# Altium project Project_Xe_Can_Bang.PrjPCB
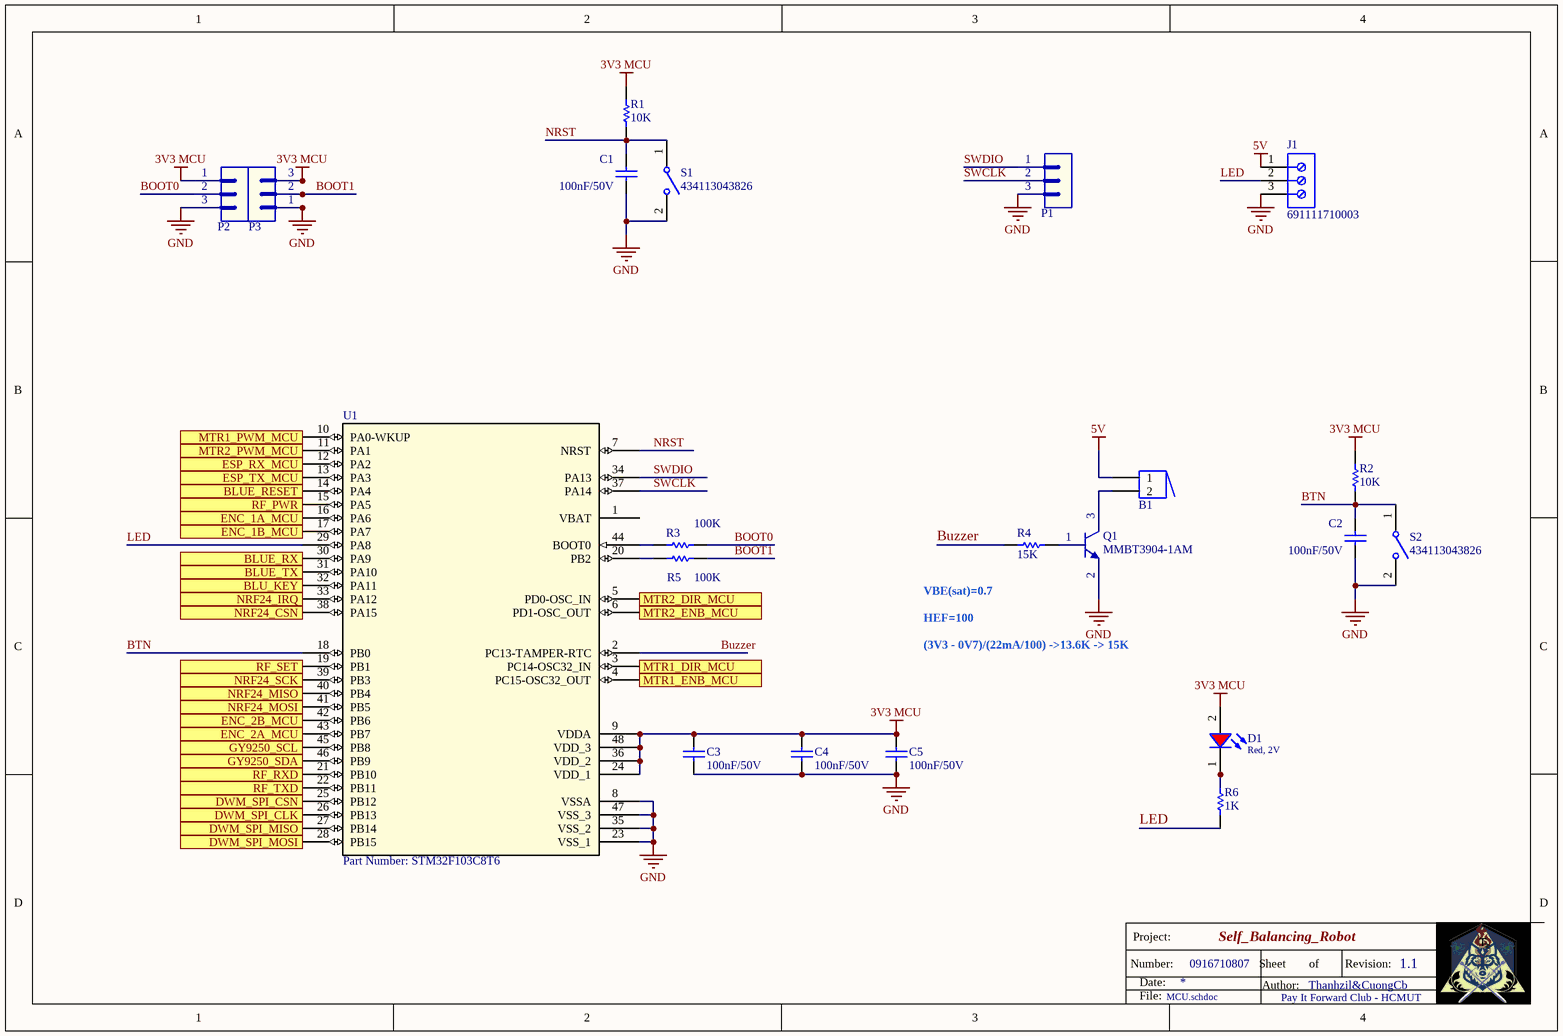
[diagram p0: MCU.SchDoc]
8 sheets, 152 parts. Net scope: flat (ports and power ports of the same name join across sheets).
Board file: Project_Xe_Can_Bang.PcbDoc
Sheets:
  MCU.SchDoc
  Power_Supply.SchDoc
  Sensor.SchDoc
  Motor_Controller.SchDoc
  Bluetooth.SchDoc
  Decawave.SchDoc
  RF.SchDoc
  Wifi.SchDoc

## Sheet MCU.SchDoc
size A4

### Parts
B1  Buzzer  [BUZZER]  (value not drawn)
C1  value 100nF/50V  [CAP-SM-0805]  (hidden comment: Cap-100nF-50V-0805)
C2  value 100nF/50V  [CAP-SM-0805]  (hidden comment: Cap-100nF-50V-0805)
C3  value 100nF/50V  [CAP-SM-0805]  (hidden comment: Cap-100nF-50V-0805)
C4  value 100nF/50V  [CAP-SM-0805]  (hidden comment: Cap-100nF-50V-0805)
C5  value 100nF/50V  [CAP-SM-0805]  (hidden comment: Cap-100nF-50V-0805)
D1  Red, 2V  [WL-SMCW_0805]
J1  691111710003  [691111710003]
P1  Header 3  [JP3]  (value not drawn)
P2  Header 3  [JP3]  (value not drawn)
P3  Header 3  [JP3]  (value not drawn)
Q1  MMBT3904-1AM  [SOT23_NEX]
R1  value 10K  [RES-SM-0805]  (hidden comment: Res-10k-0805)
R2  value 10K  [RES-SM-0805]  (hidden comment: Res-10k-0805)
R3  value 100K  [RES-SM-0805]  (hidden comment: Res-100K-0805)
R4  value 15K  [RES-SM-0805]  (hidden comment: Res-15K-0805)
R5  value 100K  [RES-SM-0805]  (hidden comment: Res-100K-0805)
R6  value 1K  [RES-SM-0805]  (hidden comment: Res-1K-0805)
S1  434113043826  [434113043826]
S2  434113043826  [434113043826]
U1  Part Number: STM32F103C8T6  [LQFP - 48]

### Ports
BLU_KEY (out), BLUE_RESET (out), BLUE_RX (out), BLUE_TX (in), DWM_SPI_CLK (out), DWM_SPI_CSN (out), DWM_SPI_MISO (in), DWM_SPI_MOSI (out), ENC_1A_MCU (in), ENC_1B_MCU (in), ENC_2A_MCU (in), ENC_2B_MCU (in), ESP_RX_MCU (out), ESP_TX_MCU (in), GY9250_SCL (out), GY9250_SDA (out), MTR1_DIR_MCU (out), MTR1_ENB_MCU (out), MTR1_PWM_MCU (out), MTR2_DIR_MCU (out), MTR2_ENB_MCU (out), MTR2_PWM_MCU (out), NRF24_CSN (out), NRF24_IRQ (in), NRF24_MISO (in), NRF24_MOSI (out), NRF24_SCK (out), RF_PWR (out), RF_RXD (out), RF_SET (out), RF_TXD (in)

### Nets
3V3 MCU: C3.2 C4.1 C5.2 D1.2(A) P2.1 P3.3 R1.2 R2.2 U1.9(VDDA) U1.24(VDD_1) U1.36(VDD_2) U1.48(VDD_3)
5V: B1.1 J1.1
GND: C1.1 C2.1 C3.1 C4.2 C5.1 J1.3 P1.3 P2.3 P3.1 Q1.2(E) S1.2 S2.2 U1.8(VSSA) U1.23(VSS_1) U1.35(VSS_2) U1.47(VSS_3)
BLU_KEY: U1.32(PA11) ; port BLU_KEY
BLUE_RX: U1.30(PA9) ; port BLUE_RX
BLUE_TX: U1.31(PA10) ; port BLUE_TX
BOOT0: P2.2 R3.2
BOOT1: P3.2 R5.2
BTN: C2.2 R2.1 S2.1 U1.18(PB0)
Buzzer: R4.1 U1.2(PC13-TAMPER-RTC)
DWM_SPI_CLK: U1.26(PB13) ; port DWM_SPI_CLK
DWM_SPI_CSn: U1.25(PB12) ; port DWM_SPI_CSN
DWM_SPI_MISO: U1.27(PB14) ; port DWM_SPI_MISO
DWM_SPI_MOSI: U1.28(PB15) ; port DWM_SPI_MOSI
ESP_TX: U1.13(PA3) ; port ESP_TX_MCU
LED: J1.2 R6.1 U1.29(PA8)
NRST: C1.2 R1.1 S1.1 U1.7(NRST)
RF_RXD: U1.21(PB10) ; port RF_RXD
RF_SET: U1.19(PB1) ; port RF_SET
RF_TXD: U1.22(PB11) ; port RF_TXD
SWCLK: P1.2 U1.37(PA14)
SWDIO: P1.1 U1.34(PA13)
NetB1_2: B1.2 Q1.3(C)
NetB2_3: U1.45(PB8) ; port GY9250_SCL
NetB2_4: U1.46(PB9) ; port GY9250_SDA
NetD1_1: D1.1(K) R6.2
NetM4_11: U1.14(PA4) ; port BLUE_RESET
NetM5_4: U1.38(PA15) ; port NRF24_CSN
NetM5_5: U1.39(PB3) ; port NRF24_SCK
NetM5_6: U1.41(PB5) ; port NRF24_MOSI
NetM5_7: U1.40(PB4) ; port NRF24_MISO
NetM5_8: U1.33(PA12) ; port NRF24_IRQ
NetQ1_1: Q1.1(B) R4.2
NetR3_1: R3.1 U1.44(BOOT0)
NetR5_1: R5.1 U1.20(PB2)
NetR8_1: U1.15(PA5) ; port RF_PWR
NetR28_1: U1.12(PA2) ; port ESP_RX_MCU
NetU1_3: U1.3(PC14-OSC32_IN) ; port MTR1_DIR_MCU
NetU1_4: U1.4(PC15-OSC32_OUT) ; port MTR1_ENB_MCU
NetU1_5: U1.5(PD0-OSC_IN) ; port MTR2_DIR_MCU
NetU1_6: U1.6(PD1-OSC_OUT) ; port MTR2_ENB_MCU
NetU1_10: U1.10(PA0-WKUP) ; port MTR1_PWM_MCU
NetU1_11: U1.11(PA1) ; port MTR2_PWM_MCU
NetU1_16: U1.16(PA6) ; port ENC_1A_MCU
NetU1_17: U1.17(PA7) ; port ENC_1B_MCU
NetU1_42: U1.42(PB6) ; port ENC_2B_MCU
NetU1_43: U1.43(PB7) ; port ENC_2A_MCU

Not connected (* = marked no-connect by the designer): U1 1(VBAT)

### Notes on the sheet
- Labels drawn without touching a wire or pin: (3V3 - 0V7)/(22mA/100) ->13.6K -> 15K, HEF=100, VBE(sat)=0.7
- Date:
- Project:
- Number:
- 0916710807
- Self_Balancing_Robot
- Sheet
- Author:
- of
- Revision:
- 1.1
- Thanhzil&CuongCb
- Pay It Forward Club - HCMUT
- File:
- MCU.schdoc

### Library data of the parts
C1-C5 = Cap-100nF-50V-0805: CAP CER 0.1UF 50V Y5V 0805; Manufacturer: Samsung Electro-Mechanics; Manufacturer Part Number: CL21F104ZBCNNNC; Local Supplier: thegioiic; Local Supplier Link: https://thegioiic.com/products/tu-100nf-0-1uf-50v-0805; Supplier 1: Digikey; Supplier 1 Part Number: 1276-1007-1-ND; Supplier 1 Link: https://www.digikey.com/product-detail/en/samsung-electro-mechanics/CL21F104ZBCNNNC/1276-1007-1-ND/3889093
D1 = 150080RS75000: WL-SMCW SMT Mono-color Chip LED Waterclear, size 0805, Red, 2V, 140deg; Chip Technology: AlInGaP; Dominant Wavelength typ.: 625nm; Luminous Intensity typ.: 150mcd; Peak Wavelength typ.: 630nm; Viewing Angle: 140deg; ComponentLink1Description: Manufacturer; ComponentLink1URL: http://www.we-online.de; ComponentLink2URL: https://www.we-online.com/catalog/datasheet/150080RS75000.pdf; ComponentLink2Description: Datasheet; Forward Voltage typ.: 2V; Emitting Color: Red; Mounting Technology: SMT; Operating Temperature: -40 to +85degC; Published Date: December 2019; Part Number: 150080RS75000; Packaging: Tape and Reel; Size: 0805; Publisher: Wurth Elektronik
J1 = 691111710003: WR-TBL Serie 111 Horizontal Entry Modular, Pressure Clamp, pitch 5mm, 3p; Compliance: Lead free / RoHS; Modularity: Yes; PCB/Cable/Panel: PCB; Pin Number: 3; Rated Current [UL]: 15A; Working Voltage [UL]: 250VAC; ComponentLink1Description: Manufacturer; ComponentLink1URL: http://www.we-online.de; ComponentLink2URL: https://katalog.we-online.de/em/datasheet/691111710003.pdf; ComponentLink2Description: Datasheet; Mounting Technology: THT; Part Number: 691111710003; Packaging: Box; Operating Temperature: -40 to +105degC; Pitch: 5mm; Published Date: October 2019; Type: Horizontal; Publisher: Wurth Elektronik; Application: Pressure Clamp
P1-P3 = Header 3: Header, 3-Pin; LatestRevisionDate: 17-Jul-2002; LatestRevisionNote: Re-released for DXP Platform.; Publisher: Altium Limited
R1 R2 = Res-10k-0805: RES 10K OHM 1% 1/4W 0805; Manufacturer: Stackpole Electronics Inc; Manufacturer Part Number: RNCP0805FTD10K0; Local Supplier: thegioiic; Local Supplier Link: https://thegioiic.com/products/dien-tro-10k-ohm-0805-5; Supplier 1: Digikey; Supplier 1 Link: https://www.digikey.com/product-detail/en/stackpole-electronics-inc/RNCP0805FTD10K0/RNCP0805FTD10K0CT-ND/2240601; Supplier 1 Part Number: RNCP0805FTD10K0CT-ND
R3 R5 = Res-100K-0805: RES 0 OHM JUMPER 0805; Manufacturer: Vishay Dale; Manufacturer Part Number: WSL080500000ZEA9; Local Supplier: thegioiic; Local Supplier Link: https://thegioiic.com/products/dien-tro-0-ohm-0805-5; Supplier 1: Digikey; Supplier 1 Link: https://www.digikey.com/product-detail/en/vishay-dale/WSL080500000ZEA9/541-3928-1-ND/7423223; Supplier 1 Part Number: 541-3928-1-ND
R4 = Res-15K-0805: RES 15K OHM 1% 1/4W 0805; Manufacturer: TE Connectivity Passive Product; Manufacturer Part Number: CRGCQ0805F15K; Local Supplier: thegioiic; Local Supplier Link: https://thegioiic.com/products/dien-tro-15k-ohm-0805-1; Supplier 1: Digikey; Supplier 1 Part Number: A129763CT-ND; Supplier 1 Link: https://www.digikey.com/product-detail/en/te-connectivity-passive-product/CRGCQ0805F15K/A129763CT-ND/8577595
R6 = Res-1K-0805: RES 1K OHM 1% 1/4W 0805; Manufacturer: Stackpole Electronics Inc; Manufacturer Part Number: RNCP0805FTD1K00; Local Supplier: thegioiic; Local Supplier Link: https://thegioiic.com/products/dien-tro-1k-ohm-0805-5; Supplier 1: Digikey; Supplier 1 Link: https://www.digikey.com/product-detail/en/stackpole-electronics-inc/RNCP0805FTD1K00/RNCP0805FTD1K00CT-ND/2240568; Supplier 1 Part Number: RNCP0805FTD1K00CT-ND
S1 S2 = 434113043826: WS-TASV J-Bend SMT Tact Switch 6x3.5mm, height 4.3mm, 260gf; Rated Voltage: 12VDC; Rated Current: 50mA; Washable: No; ComponentLink1Description: Manufacturer; ComponentLink1URL: http://www.we-online.de; ComponentLink2Description: Datasheet; ComponentLink2URL: https://katalog.we-online.com/em/datasheet/434113043826.pdf; Operating Temperature: -40 to +85degC; Part Number: 434113043826; Published Date: September 2019; Contact Material: Stainless Steel; Height: 4.3mm; Mounting Technology: SMT; Contact Plating: Silver; Operation Force: 260gf; Packaging: Tape and Reel; Terminal Material: Copper Alloy; Publisher: Wurth Elektronik; Terminal Plating: Silver
U1 = STM32F103C8T6: Vendor: STMicroelectronics; Built_By: EMA_UL_Team; Manufacturer_Part_Number: STM32F103C8T6; Copyright: Copyright (C) 2018 Accelerated Designs. All rights reserved; RefDes: RefDes; Type: DEV; Value: Value

## Sheet Power_Supply.SchDoc
size A4
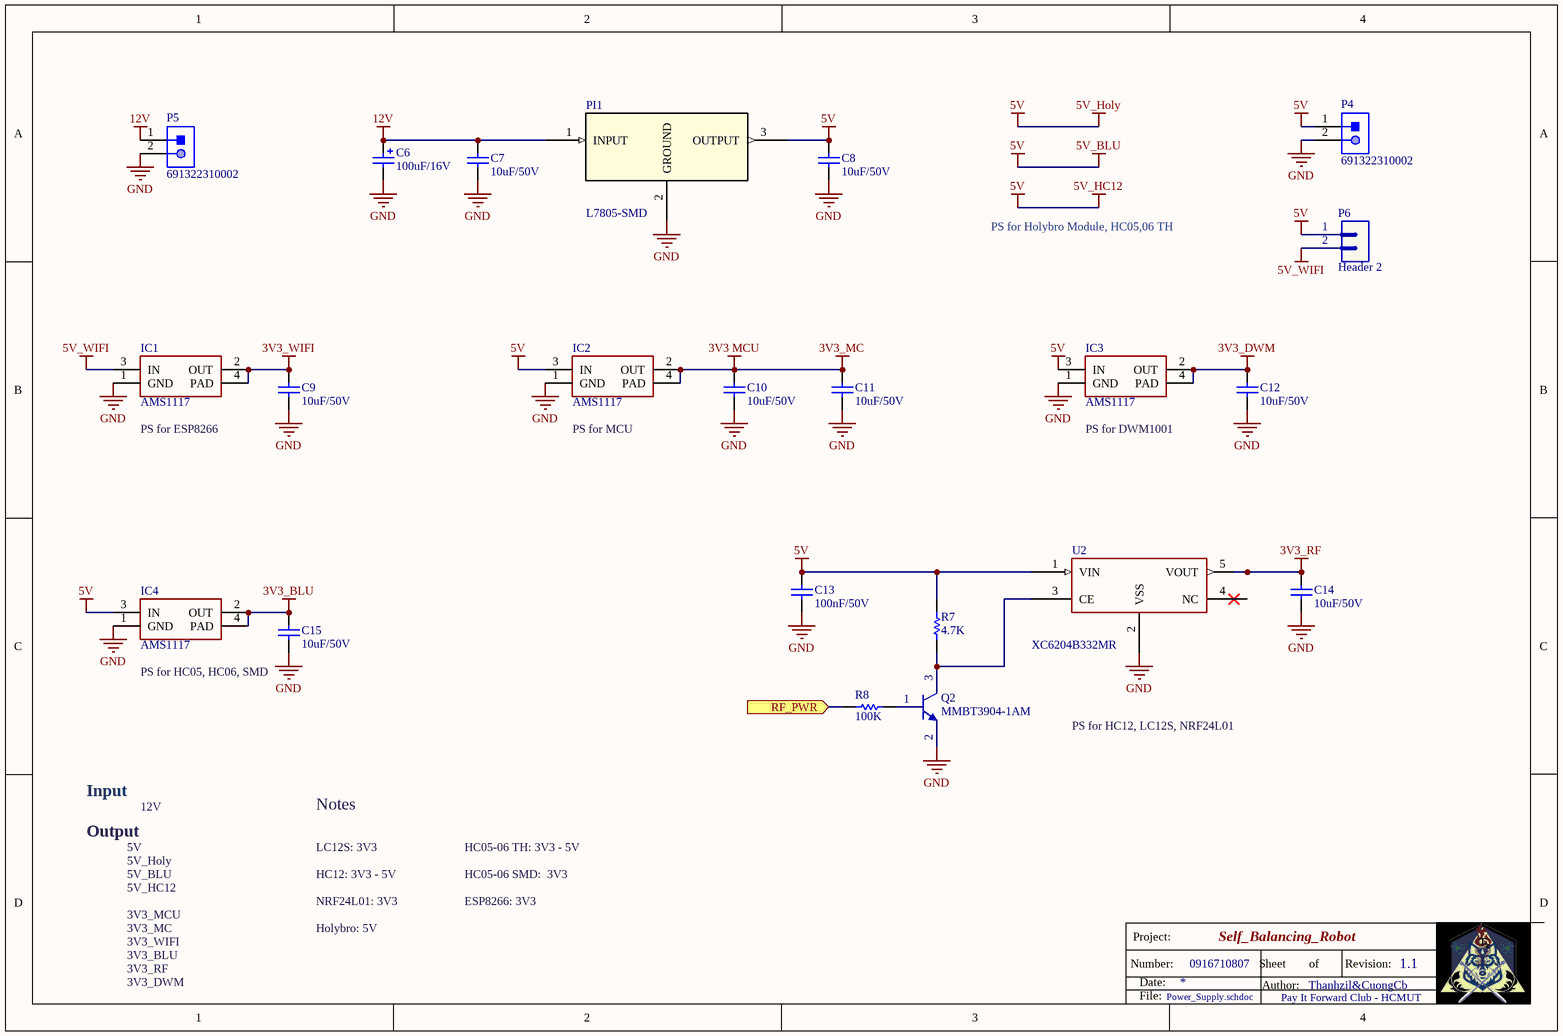
[diagram p1: Power_Supply.SchDoc]

### Parts
C6  value 100uF/16V  [CAP-SM-AL-SIZE-D-D6L6]  (hidden comment: Cap-Al-100uF-16V-D6L5)
C7  value 10uF/50V  [CAP-SM-0805]  (hidden comment: Cap-10uF-50V-0805)
C8  value 10uF/50V  [CAP-SM-0805]  (hidden comment: Cap-10uF-50V-0805)
C9  value 10uF/50V  [CAP-SM-0805]  (hidden comment: Cap-10uF-50V-0805)
C10  value 10uF/50V  [CAP-SM-0805]  (hidden comment: Cap-10uF-50V-0805)
C11  value 10uF/50V  [CAP-SM-0805]  (hidden comment: Cap-10uF-50V-0805)
C12  value 10uF/50V  [CAP-SM-0805]  (hidden comment: Cap-10uF-50V-0805)
C13  value 100nF/50V  [CAP-SM-0805]  (hidden comment: Cap-100nF-50V-0805)
C14  value 10uF/50V  [CAP-SM-0805]  (hidden comment: Cap-10uF-50V-0805)
C15  value 10uF/50V  [CAP-SM-0805]  (hidden comment: Cap-10uF-50V-0805)
IC1  AMS1117  [SOT223]
IC2  AMS1117  [SOT223]
IC3  AMS1117  [SOT223]
IC4  AMS1117  [SOT223]
P4  691322310002  [691322310002]
P5  691322310002  [691322310002]
P6  Header 2  [JP2]
PI1  L7805-SMD  [D2PAK_STM]
Q2  MMBT3904-1AM  [SOT23_NEX]
R7  value 4.7K  [RES-SM-0805]  (hidden comment: Res-4.7K-0805)
R8  value 100K  [RES-SM-0805]  (hidden comment: Res-100K-0805)
U2  XC6204B332MR  [XC6204/05_SOT-00]

### Ports
RF_PWR (in)

### Nets
3V3 MCU: C10.2 C11.2 IC2.2(OUT) IC2.4(PAD)  [also labelled 3V3_MC]
3V3_BLU: C15.2 IC4.2(OUT) IC4.4(PAD)
3V3_DWM: C12.2 IC3.2(OUT) IC3.4(PAD)
3V3_RF: C14.2 U2.5(VOUT)
3V3_WIFI: C9.2 IC1.2(OUT) IC1.4(PAD)
5V: C8.2 C13.2 IC2.3(IN) IC3.3(IN) IC4.3(IN) P4.1 P6.1 PI1.3(OUTPUT) R7.2 U2.1(VIN)  [also labelled 5V_BLU, 5V_HC12, 5V_Holy]
5V_WIFI: IC1.3(IN) P6.2
12V: C6.1 C7.2 P5.1 PI1.1(INPUT)
GND: C6.2 C7.1 C8.1 C9.1 C10.1 C11.1 C12.1 C13.1 C14.1 C15.1 IC1.1(GND) IC2.1(GND) IC3.1(GND) IC4.1(GND) P4.2 P5.2 PI1.2(GROUND) Q2.2(E) U2.2(VSS)
NetQ2_1: Q2.1(B) R8.2
NetQ2_3: Q2.3(C) R7.1 U2.3(CE)
NetR8_1: R8.1 ; port RF_PWR

Not connected (* = marked no-connect by the designer): U2 4(NC)

### Notes on the sheet
- Labels drawn without touching a wire or pin: 3V3_BLU, 3V3_DWM, 3V3_MC, 3V3_MCU, 3V3_RF, 3V3_WIFI, 5V, 5V_BLU, 5V_HC12, 5V_Holy, 12V, ESP8266: 3V3, HC05-06 SMD:  3V3, HC05-06 TH: 3V3 - 5V, HC12: 3V3 - 5V, Holybro: 5V, Input, LC12S: 3V3, Notes, NRF24L01: 3V3, Output, PS for DWM1001, PS for ESP8266, PS for HC05, HC06, SMD, PS for HC12, LC12S, NRF24L01, PS for Holybro Module, HC05,06 TH, PS for MCU
- Date:
- Project:
- Number:
- 0916710807
- Self_Balancing_Robot
- Sheet
- Author:
- of
- Revision:
- 1.1
- Thanhzil&CuongCb
- Pay It Forward Club - HCMUT
- File:
- Power_Supply.schdoc

### Library data of the parts
C6 = Cap-Al-100uF-16V-D6L5: CAP ALUM 100UF 20% 16V SMD; Manufacturer: Nichicon; Manufacturer Part Number: UWX1C101MCL1GB; Local Supplier: thegioiic; Local Supplier Link: https://thegioiic.com/products/tu-nhom-smd-100uf-16v-d6-3l5-4; Supplier 1: Digikey; Supplier 1 Part Number: 493-2105-1-ND; Supplier 1 Link: https://www.digikey.com/product-detail/en/nichicon/UWX1C101MCL1GB/493-2105-1-ND/590080
C7-C12 C14 C15 = Cap-10uF-50V-0805: CAP CER 10UF 50V X5R 0805; Manufacturer: Yageo; Manufacturer Part Number: CC0805KKX5R9BB106; Local Supplier: thegioiic; Local Supplier Link: https://thegioiic.com/products/tu-10uf-50v-0805; Supplier 1: Digikey; Supplier 1 Link: https://www.digikey.com/product-detail/en/yageo/CC0805KKX5R9BB106/311-3499-2-ND/7164383; Supplier 1 Part Number: 311-3499-2-ND
C13 = Cap-100nF-50V-0805: as C1 on sheet MCU; Local Supplier: thegioiic; Local Supplier Link: https://thegioiic.com/products/tu-100nf-0-1uf-50v-0805; Supplier 1: Digikey; Supplier 1 Part Number: 1276-1007-1-ND; Supplier 1 Link: https://www.digikey.com/product-detail/en/samsung-electro-mechanics/CL21F104ZBCNNNC/1276-1007-1-ND/3889093
IC1-IC4 = AMS1117: Available in 1.8V, 2.5V, 2.85V, 3.3V, 5V, and  Adjustable Versions; Value: LM317
P4 P5 = 691322310002: WR-TBL Serie 322 Horizontal PCB Header, Pluggable, pitch 3.81mm, 2p; Compliance: RoHS; Modularity: No; Pin Number: 2; Rated Current [UL]: 10A; Working Voltage [UL]: 300VAC; ComponentLink1Description: Manufacturer; ComponentLink1URL: http://www.we-online.de; ComponentLink2URL: https://katalog.we-online.de/em/datasheet/691322310002.pdf; ComponentLink2Description: Datasheet; Mounting Technology: THT; Part Number: 691322310002; Packaging: Box; Operating Temperature: -40 to +105degC; PCB/Cable/Panel: PCB; Pitch: 3.81mm; Published Date: October 2019; Type: Horizontal; Publisher: Wurth Elektronik; Application: Pluggable
P6 = Header 2: Header, 2-Pin; LatestRevisionDate: 17-Jul-2002; LatestRevisionNote: Re-released for DXP Platform.; Publisher: Altium Limited
PI1 = L7805CD2T-TR: No Description Available; SourceLibrary: StMicro_2011-06-07; Built_By: EMA_UL_Team; Vendor: STMicroelectronics; Manufacturer_Part_Number: L7805CD2T-TR; Copyright: Copyright (C) 2018 Accelerated Designs. All rights reserved; RefDes: RefDes; Type: DEV
R7 = Res-4.7K-0805: RES SMD 4.7K OHM 5% 1/8W 0805; Manufacturer: Yageo; Manufacturer Part Number: RC0805JR-074K7L; Local Supplier: thegioiic; Local Supplier Link: https://thegioiic.com/products/dien-tro-4-7k-ohm-0805-5; Supplier 1: Digikey; Supplier 1 Link: https://www.digikey.com/product-detail/en/yageo/RC0805JR-074K7L/311-4.7KARCT-ND/731274; Supplier 1 Part Number: 311-4.7KARCT-ND
R8 = Res-100K-0805: as R3 on sheet MCU; Local Supplier: thegioiic; Local Supplier Link: https://thegioiic.com/products/dien-tro-0-ohm-0805-5; Supplier 1: Digikey; Supplier 1 Link: https://www.digikey.com/product-detail/en/vishay-dale/WSL080500000ZEA9/541-3928-1-ND/7423223; Supplier 1 Part Number: 541-3928-1-ND
U2 = XC6204B332MR: Vendor: Torex Semiconductor; Built_By: EMA_UL_Team; SourceLibrary: Torex_2016-07-05_1; Manufacturer_Part_Number: XC6204B332MR; Copyright: Copyright (C) 2018 Accelerated Designs. All rights reserved; RefDes: RefDes; Type: DEV

## Sheet Sensor.SchDoc
size A4
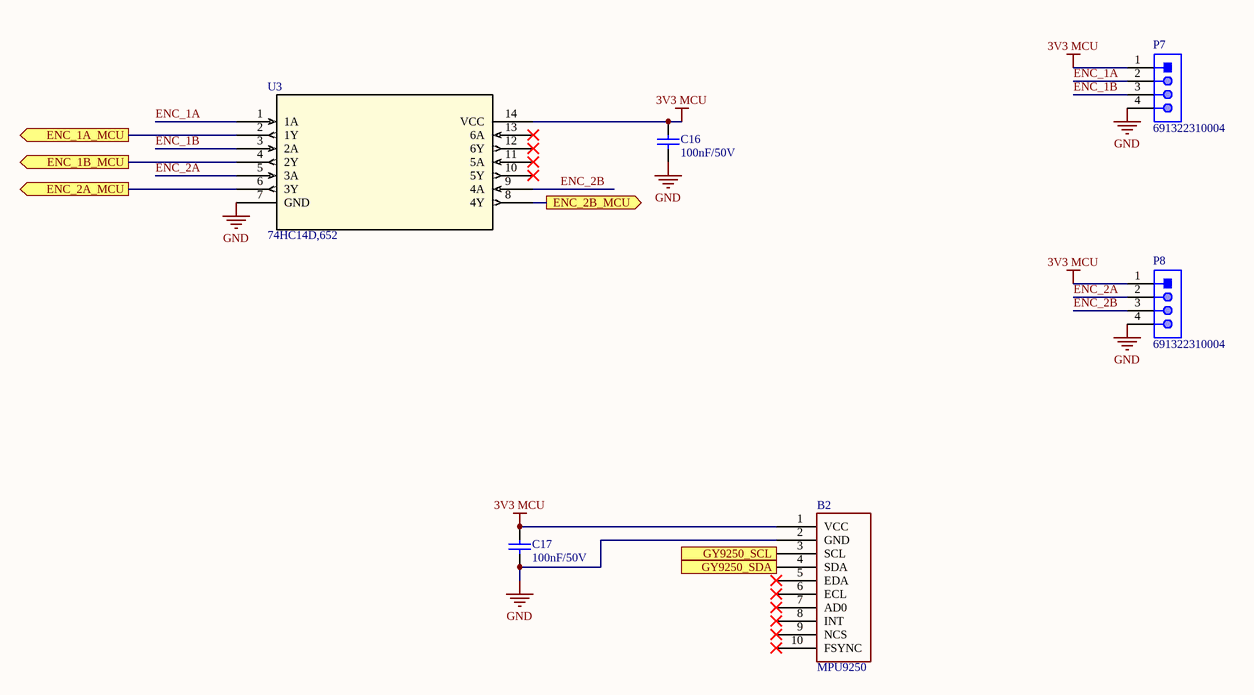
[diagram p2: Sensor.SchDoc]

### Parts
B2  MPU9250  [MPU9250]
C16  value 100nF/50V  [CAP-SM-0805]  (hidden comment: Cap-100nF-50V-0805)
C17  value 100nF/50V  [CAP-SM-0805]  (hidden comment: Cap-100nF-50V-0805)
P7  691322310004  [691322310004]
P8  691322310004  [691322310004]
U3  74HC14D,652  [SOT108-1_NEX]

### Ports
ENC_1A_MCU (out), ENC_1B_MCU (out), ENC_2A_MCU (out), ENC_2B_MCU (out), GY9250_SCL (in), GY9250_SDA (in)

### Nets
3V3 MCU: B2.1(VCC) C16.2 C17.2 P7.1 P8.1 U3.14(VCC)
GND: B2.2(GND) C16.1 C17.1 P7.4 P8.4 U3.7(GND)
ENC_1A: P7.2 U3.1(1A)
ENC_1B: P7.3 U3.3(2A)
ENC_2A: P8.2 U3.5(3A)
ENC_2B: P8.3 U3.9(4A)
NetB2_3: B2.3(SCL) ; port GY9250_SCL
NetB2_4: B2.4(SDA) ; port GY9250_SDA
NetU1_16: U3.2(1Y) ; port ENC_1A_MCU
NetU1_17: U3.4(2Y) ; port ENC_1B_MCU
NetU1_42: U3.8(4Y) ; port ENC_2B_MCU
NetU1_43: U3.6(3Y) ; port ENC_2A_MCU

Not connected (* = marked no-connect by the designer): B2 5(EDA)* 6(ECL)* 7(AD0)* 8(INT)* 9(NCS)* 10(FSYNC)*; U3 10(5Y)* 11(5A)* 12(6Y)* 13(6A)*

### Notes on the sheet
- Date:
- Project:
- Number:
- 0916710807
- Self_Balancing_Robot
- Sheet
- Author:
- of
- Revision:
- 1.1
- Thanhzil&CuongCb
- Pay It Forward Club - HCMUT
- File:
- Sensor.schdoc

### Library data of the parts
C16 C17 = Cap-100nF-50V-0805: as C1 on sheet MCU; Local Supplier: thegioiic; Local Supplier Link: https://thegioiic.com/products/tu-100nf-0-1uf-50v-0805; Supplier 1: Digikey; Supplier 1 Part Number: 1276-1007-1-ND; Supplier 1 Link: https://www.digikey.com/product-detail/en/samsung-electro-mechanics/CL21F104ZBCNNNC/1276-1007-1-ND/3889093
P7 P8 = 691322310004: WR-TBL Serie 322 Horizontal PCB Header, Pluggable, pitch 3.81mm, 4p; Compliance: RoHS; Modularity: No; Pin Number: 4; Rated Current [UL]: 10A; Working Voltage [UL]: 300VAC; ComponentLink1Description: Manufacturer; ComponentLink1URL: http://www.we-online.de; ComponentLink2URL: https://katalog.we-online.de/em/datasheet/691322310004.pdf; ComponentLink2Description: Datasheet; Mounting Technology: THT; Part Number: 691322310004; Packaging: Box; Operating Temperature: -40 to +105degC; PCB/Cable/Panel: PCB; Pitch: 3.81mm; Published Date: October 2019; Type: Horizontal; Publisher: Wurth Elektronik; Application: Pluggable
U3 = 74HC14D,652: No Description Available; Vendor: Nexperia; SourceLibrary: Nexperia_2018-05-2018; Manufacturer_Part_Number: 74HC14D,652; Copyright: Copyright (C) 2016 Accelerated Designs. All rights reserved; RefDes: RefDes; Type: DEV

## Sheet Motor_Controller.SchDoc
size A4
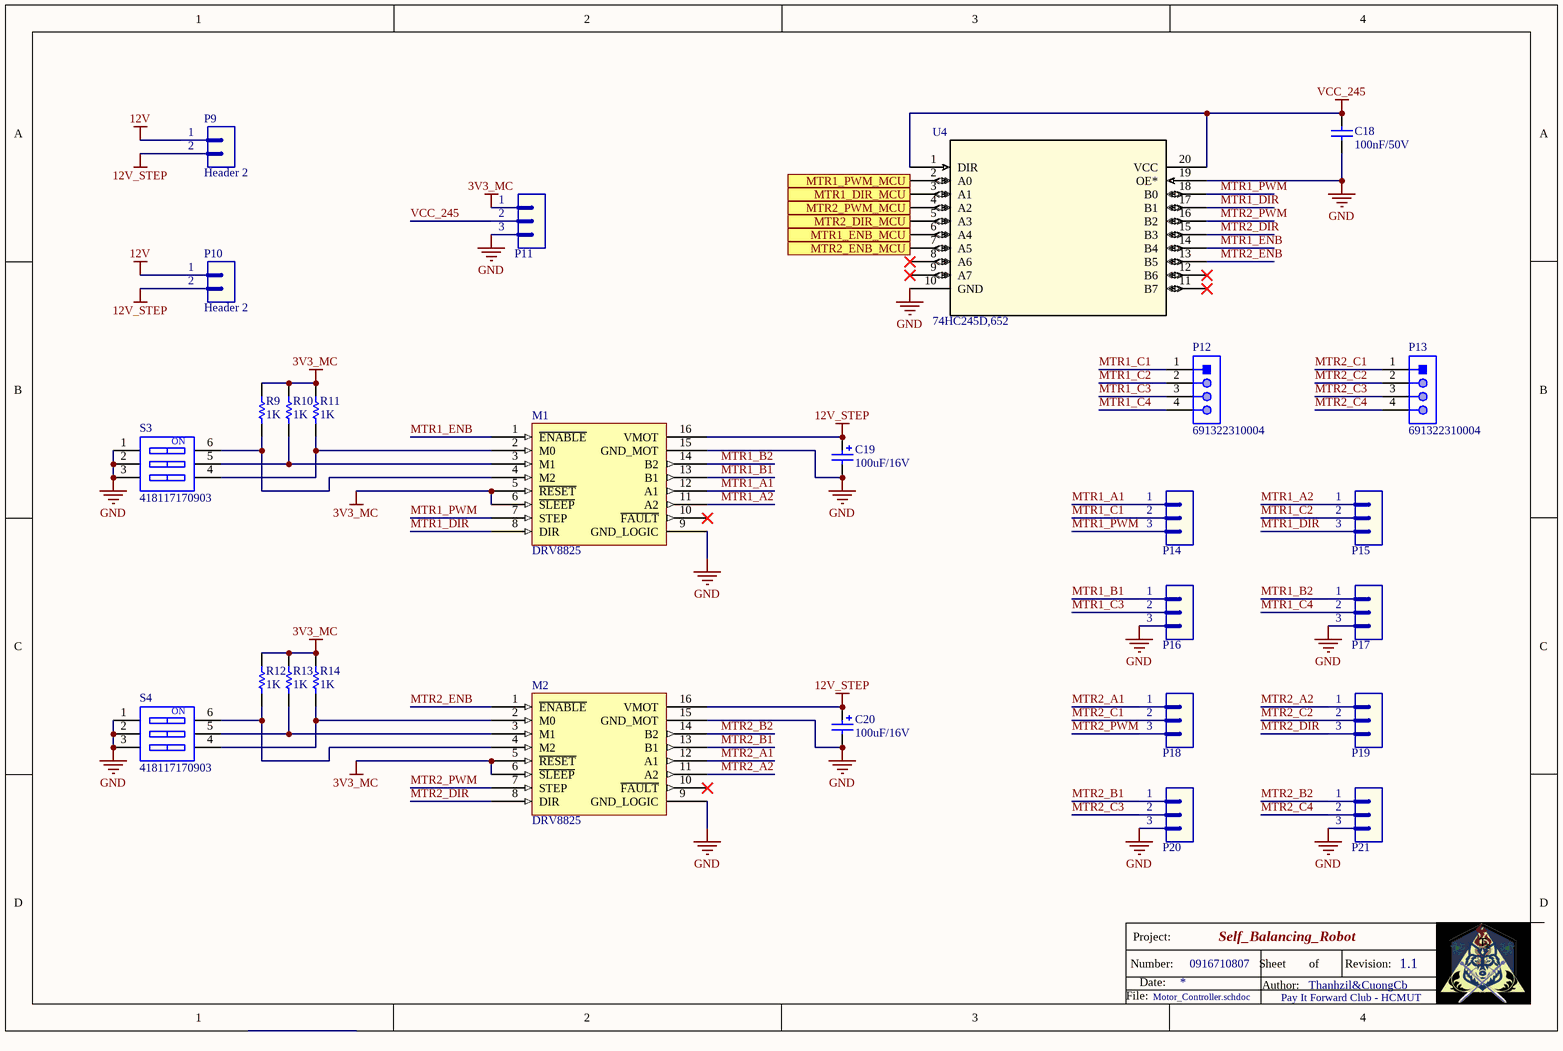
[diagram p3: Motor_Controller.SchDoc]

### Parts
C18  value 100nF/50V  [CAP-SM-0805]  (hidden comment: Cap-100nF-50V-0805)
C19  value 100uF/16V  [CAP-SM-AL-SIZE-D-D6L6]  (hidden comment: Cap-Al-100uF-16V-D6L5)
C20  value 100uF/16V  [CAP-SM-AL-SIZE-D-D6L6]  (hidden comment: Cap-Al-100uF-16V-D6L5)
M1  DRV8825  [IC_DRV8825_STEPPER_MOTOR_DRIVER_CARRIER]
M2  DRV8825  [IC_DRV8825_STEPPER_MOTOR_DRIVER_CARRIER]
P9  Header 2  [JP2]
P10  Header 2  [JP2]
P11  Header 3  [JP3]  (value not drawn)
P12  691322310004  [691322310004]
P13  691322310004  [691322310004]
P14  Header 3  [JP3]  (value not drawn)
P15  Header 3  [JP3]  (value not drawn)
P16  Header 3  [JP3]  (value not drawn)
P17  Header 3  [JP3]  (value not drawn)
P18  Header 3  [JP3]  (value not drawn)
P19  Header 3  [JP3]  (value not drawn)
P20  Header 3  [JP3]  (value not drawn)
P21  Header 3  [JP3]  (value not drawn)
R9  value 1K  [RES-SM-0805]  (hidden comment: Res-1K-0805)
R10  value 1K  [RES-SM-0805]  (hidden comment: Res-1K-0805)
R11  value 1K  [RES-SM-0805]  (hidden comment: Res-1K-0805)
R12  value 1K  [RES-SM-0805]  (hidden comment: Res-1K-0805)
R13  value 1K  [RES-SM-0805]  (hidden comment: Res-1K-0805)
R14  value 1K  [RES-SM-0805]  (hidden comment: Res-1K-0805)
S3  418117170903  [418117170903]
S4  418117170903  [418117170903]
U4  74HC245D,652  [SOT163-1_NEX]

### Ports
MTR1_DIR_MCU (in), MTR1_ENB_MCU (in), MTR1_PWM_MCU (in), MTR2_DIR_MCU (in), MTR2_ENB_MCU (in), MTR2_PWM_MCU (in)

### Nets
3V3_MC: M1.5(~{RESET}) M1.6(~{SLEEP}) M2.5(~{RESET}) M2.6(~{SLEEP}) P11.1 R9.1 R10.1 R11.1 R12.1 R13.1 R14.1  [project net 3V3 MCU]
12V: P9.1 P10.1
12V_STEP: C19.1 C20.1 M1.16(VMOT) M2.16(VMOT) P9.2 P10.2
GND: C18.1 C19.2 C20.2 M1.9(GND_LOGIC) M1.15(GND_MOT) M2.9(GND_LOGIC) M2.15(GND_MOT) P11.3 P16.3 P17.3 P20.3 P21.3 S3.1 S3.2 S3.3 S4.1 S4.2 S4.3 U4.10(GND) U4.19(OE*)
VCC_245: C18.2 P11.2 U4.1(DIR) U4.20(VCC)
MTR1_A1: M1.12(A1) P14.1
MTR1_A2: M1.11(A2) P15.1
MTR1_B1: M1.13(B1) P16.1
MTR1_B2: M1.14(B2) P17.1
MTR1_C1: P12.1 P14.2
MTR1_C2: P12.2 P15.2
MTR1_C3: P12.3 P16.2
MTR1_C4: P12.4 P17.2
MTR1_DIR: M1.8(DIR) P15.3 U4.17(B1)
MTR1_ENB: M1.1(~{ENABLE}) U4.14(B4)
MTR1_PWM: M1.7(STEP) P14.3 U4.18(B0)
MTR2_A1: M2.12(A1) P18.1
MTR2_A2: M2.11(A2) P19.1
MTR2_B1: M2.13(B1) P20.1
MTR2_B2: M2.14(B2) P21.1
MTR2_C1: P13.1 P18.2
MTR2_C2: P13.2 P19.2
MTR2_C3: P13.3 P20.2
MTR2_C4: P13.4 P21.2
MTR2_DIR: M2.8(DIR) P19.3 U4.15(B3)
MTR2_ENB: M2.1(~{ENABLE}) U4.13(B5)
MTR2_PWM: M2.7(STEP) P18.3 U4.16(B2)
NetM1_2: M1.2(M0) R11.2 S3.4
NetM1_3: M1.3(M1) R10.2 S3.5
NetM1_4: M1.4(M2) R9.2 S3.6
NetM2_2: M2.2(M0) R14.2 S4.4
NetM2_3: M2.3(M1) R13.2 S4.5
NetM2_4: M2.4(M2) R12.2 S4.6
NetU1_3: U4.3(A1) ; port MTR1_DIR_MCU
NetU1_4: U4.6(A4) ; port MTR1_ENB_MCU
NetU1_5: U4.5(A3) ; port MTR2_DIR_MCU
NetU1_6: U4.7(A5) ; port MTR2_ENB_MCU
NetU1_10: U4.2(A0) ; port MTR1_PWM_MCU
NetU1_11: U4.4(A2) ; port MTR2_PWM_MCU

Not connected (* = marked no-connect by the designer): M1 10(~{FAULT})*; M2 10(~{FAULT})*; U4 8(A6)* 9(A7)* 11(B7)* 12(B6)*

### Notes on the sheet
- Date:
- Project:
- Number:
- 0916710807
- Self_Balancing_Robot
- Sheet
- Author:
- of
- Revision:
- 1.1
- Thanhzil&CuongCb
- Pay It Forward Club - HCMUT
- File:
- Motor_Controller.schdoc
- (in symbol 418117170903) ON

### Library data of the parts
C18 = Cap-100nF-50V-0805: as C1 on sheet MCU; Local Supplier: thegioiic; Local Supplier Link: https://thegioiic.com/products/tu-100nf-0-1uf-50v-0805; Supplier 1: Digikey; Supplier 1 Part Number: 1276-1007-1-ND; Supplier 1 Link: https://www.digikey.com/product-detail/en/samsung-electro-mechanics/CL21F104ZBCNNNC/1276-1007-1-ND/3889093
C19 C20 = Cap-Al-100uF-16V-D6L5: as C6 on sheet Power_Supply; Local Supplier: thegioiic; Local Supplier Link: https://thegioiic.com/products/tu-nhom-smd-100uf-16v-d6-3l5-4; Supplier 1: Digikey; Supplier 1 Part Number: 493-2105-1-ND; Supplier 1 Link: https://www.digikey.com/product-detail/en/nichicon/UWX1C101MCL1GB/493-2105-1-ND/590080
P9 P10 = Header 2: Header, 2-Pin; LatestRevisionDate: 17-Jul-2002; LatestRevisionNote: Re-released for DXP Platform.; Publisher: Altium Limited
P11 P14-P21 = Header 3: Header, 3-Pin; LatestRevisionDate: 17-Jul-2002; LatestRevisionNote: Re-released for DXP Platform.; Publisher: Altium Limited
P12 P13 = 691322310004: as P7 on sheet Sensor; ComponentLink1Description: Manufacturer; ComponentLink1URL: http://www.we-online.de; ComponentLink2URL: https://katalog.we-online.de/em/datasheet/691322310004.pdf; ComponentLink2Description: Datasheet; Mounting Technology: THT; Part Number: 691322310004; Packaging: Box; Operating Temperature: -40 to +105degC; PCB/Cable/Panel: PCB; Pitch: 3.81mm; Published Date: October 2019; Type: Horizontal; Publisher: Wurth Elektronik; Application: Pluggable
R9-R14 = Res-1K-0805: as R6 on sheet MCU; Local Supplier: thegioiic; Local Supplier Link: https://thegioiic.com/products/dien-tro-1k-ohm-0805-5; Supplier 1: Digikey; Supplier 1 Link: https://www.digikey.com/product-detail/en/stackpole-electronics-inc/RNCP0805FTD1K00/RNCP0805FTD1K00CT-ND/2240568; Supplier 1 Part Number: RNCP0805FTD1K00CT-ND
S3 S4 = 418117170903: WS-DITV Compact THT Dip Switch, Flat Actuator, pitch 2.54mm, 3p; Operation Force: 800g; Pole Number: 3; Actuator Type: Flat Type; Circuit: SPST-NO; Rated Current Switching: 25mA; Rated Current Non-Switching: 100mA; Rated Voltage Non-Switching: 50VDC; Rated Voltage Switching: 24VDC; ComponentLink1Description: Manufacturer; ComponentLink1URL: http://www.we-online.de; ComponentLink2Description: Datasheet; ComponentLink2URL: https://katalog.we-online.com/em/datasheet/418117170903.pdf; Pitch: 2.54mm; Contact Material: Copper Alloy; Mounting Technology: THT; Operating Temperature: -40 to +85degC; Contact Plating: Gold; Packaging: Tube; Part Number: 418117170903; Publisher: Wurth Elektronik; Published Date: September 2019
U4 = 74HC245D,652: No Description Available; Vendor: Nexperia; SourceLibrary: Nexperia_2018-05-2018; Manufacturer_Part_Number: 74HC245D,652; Copyright: Copyright (C) 2016 Accelerated Designs. All rights reserved; RefDes: RefDes; Type: DEV

## Sheet Bluetooth.SchDoc
size A4
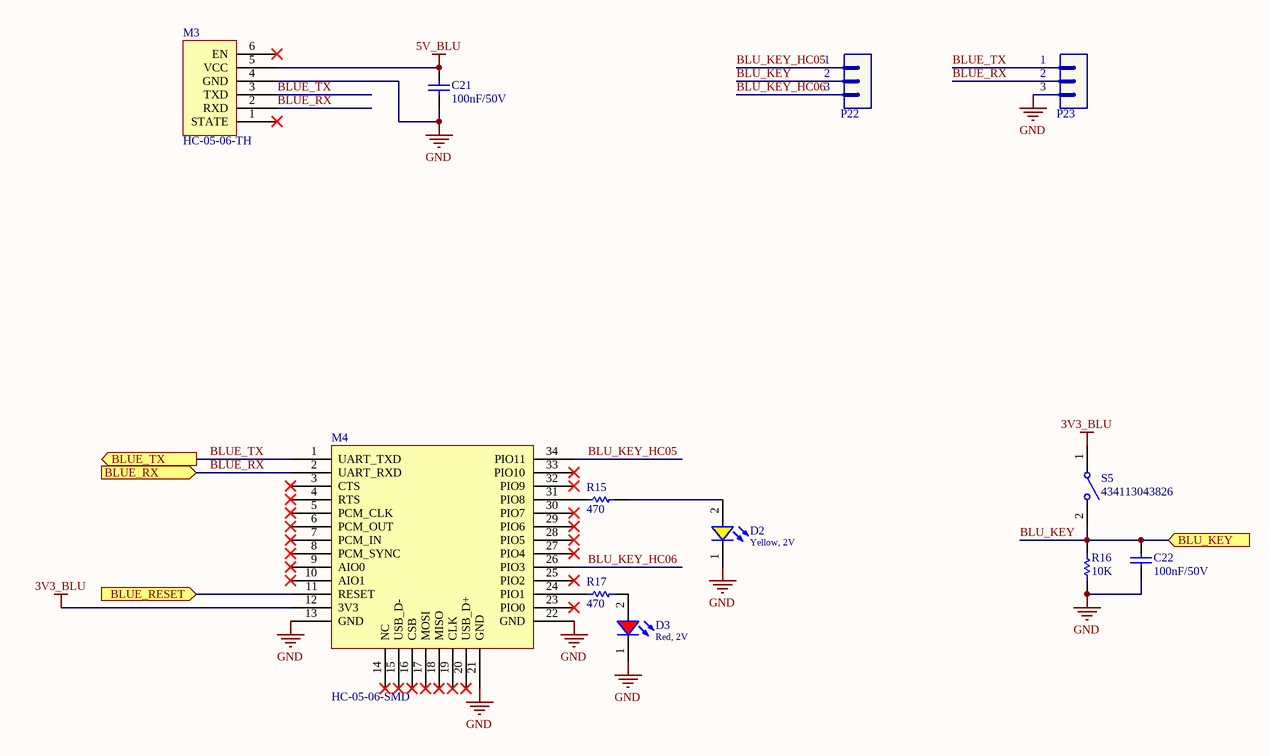
[diagram p4: Bluetooth.SchDoc]

### Parts
C21  value 100nF/50V  [CAP-SM-0805]  (hidden comment: Cap-100nF-50V-0805)
C22  value 100nF/50V  [CAP-SM-0805]  (hidden comment: Cap-100nF-50V-0805)
D2  Yellow, 2V  [WL-SMCW_0805]
D3  Red, 2V  [WL-SMCW_0805]
M3  HC-05-06-TH  [HC-05-06-TH]
M4  HC-05-06-SMD  [HC-05-06-SMD]
P22  Header 3  [JP3]  (value not drawn)
P23  Header 3  [JP3]  (value not drawn)
R15  value 470  [RES-SM-0805]  (hidden comment: Res-470-0805)
R16  value 10K  [RES-SM-0805]  (hidden comment: Res-10k-0805)
R17  value 470  [RES-SM-0805]  (hidden comment: Res-470-0805)
S5  434113043826  [434113043826]

### Ports
BLU_KEY (in), BLUE_RESET (in), BLUE_RX (in), BLUE_TX (out)

### Nets
3V3_BLU: M4.12(3V3) S5.1
5V_BLU: C21.2 M3.5(VCC)  [project net 5V]
GND: C21.1 C22.1 D2.1(K) D3.1(K) M3.4(GND) M4.13(GND) M4.21(GND) M4.22(GND) P23.3 R16.1
BLU_KEY: C22.2 P22.2 R16.2 S5.2 ; port BLU_KEY
BLU_KEY_HC05: M4.34(PIO11) P22.1
BLU_KEY_HC06: M4.26(PIO3) P22.3
BLUE_RX: M3.2(RXD) M4.2(UART_RXD) P23.2 ; port BLUE_RX
BLUE_TX: M3.3(TXD) M4.1(UART_TXD) P23.1 ; port BLUE_TX
NetD2_2: D2.2(A) R15.2
NetD3_2: D3.2(A) R17.2
NetM4_11: M4.11(RESET) ; port BLUE_RESET
NetM4_24: M4.24(PIO1) R17.1
NetM4_31: M4.31(PIO8) R15.1

Not connected (* = marked no-connect by the designer): M3 1(STATE)* 6(EN)*; M4 3(CTS)* 4(RTS)* 5(PCM_CLK)* 6(PCM_OUT)* 7(PCM_IN)* 8(PCM_SYNC)* 9(AIO0)* 10(AIO1)* 14(NC)* 15(USB_D-)* 16(CSB)* 17(MOSI)* 18(MISO)* 19(CLK)* 20(USB_D+)* 23(PIO0)* 25(PIO2)* 27(PIO4)* 28(PIO5)* 29(PIO6)* 30(PIO7)* 32(PIO9)* 33(PIO10)*

### Notes on the sheet
- Date:
- Project:
- Number:
- 0916710807
- Self_Balancing_Robot
- Sheet
- Author:
- of
- Revision:
- 1.1
- Thanhzil&CuongCb
- Pay It Forward Club - HCMUT
- File:
- Bluetooth.schdoc

### Library data of the parts
C21 C22 = Cap-100nF-50V-0805: as C1 on sheet MCU; Local Supplier: thegioiic; Local Supplier Link: https://thegioiic.com/products/tu-100nf-0-1uf-50v-0805; Supplier 1: Digikey; Supplier 1 Part Number: 1276-1007-1-ND; Supplier 1 Link: https://www.digikey.com/product-detail/en/samsung-electro-mechanics/CL21F104ZBCNNNC/1276-1007-1-ND/3889093
D2 = 150080YS75000: WL-SMCW SMT Mono-color Chip LED Waterclear, size 0805, Yellow, 2V, 140deg; Chip Technology: AlInGaP; Dominant Wavelength typ.: 590nm; Luminous Intensity typ.: 120mcd; Peak Wavelength typ.: 595nm; Viewing Angle: 140deg; ComponentLink1Description: Manufacturer; ComponentLink1URL: http://www.we-online.de; ComponentLink2URL: https://www.we-online.com/catalog/datasheet/150080YS75000.pdf; ComponentLink2Description: Datasheet; Forward Voltage typ.: 2V; Emitting Color: Yellow; Mounting Technology: SMT; Operating Temperature: -40 to +85degC; Published Date: December 2019; Part Number: 150080YS75000; Packaging: Tape and Reel; Size: 0805; Publisher: Wurth Elektronik
D3 = 150080RS75000: as D1 on sheet MCU; Viewing Angle: 140deg; ComponentLink1Description: Manufacturer; ComponentLink1URL: http://www.we-online.de; ComponentLink2URL: https://www.we-online.com/catalog/datasheet/150080RS75000.pdf; ComponentLink2Description: Datasheet; Forward Voltage typ.: 2V; Emitting Color: Red; Mounting Technology: SMT; Operating Temperature: -40 to +85degC; Published Date: December 2019; Part Number: 150080RS75000; Packaging: Tape and Reel; Size: 0805; Publisher: Wurth Elektronik
P22 P23 = Header 3: Header, 3-Pin; LatestRevisionDate: 17-Jul-2002; LatestRevisionNote: Re-released for DXP Platform.; Publisher: Altium Limited
R15 R17 = Res-470-0805: RES 470 OHM JUMPER 0805; Manufacturer: YAG6006CT-ND; Manufacturer Part Number: PE0805FRF7W0R047L; Local Supplier: thegioiic; Local Supplier Link: https://www.thegioiic.com/products/dien-tro-470-kohm-0805-5; Supplier 1: Digikey; Supplier 1 Link: https://www.digikey.com/product-detail/en/yageo/PE0805FRF7W0R047L/YAG6006CT-ND/9696460; Supplier 1 Part Number: YAG6006CT-ND
R16 = Res-10k-0805: as R1 on sheet MCU; Local Supplier: thegioiic; Local Supplier Link: https://thegioiic.com/products/dien-tro-10k-ohm-0805-5; Supplier 1: Digikey; Supplier 1 Link: https://www.digikey.com/product-detail/en/stackpole-electronics-inc/RNCP0805FTD10K0/RNCP0805FTD10K0CT-ND/2240601; Supplier 1 Part Number: RNCP0805FTD10K0CT-ND
S5 = 434113043826: as S1 on sheet MCU; ComponentLink1Description: Manufacturer; ComponentLink1URL: http://www.we-online.de; ComponentLink2Description: Datasheet; ComponentLink2URL: https://katalog.we-online.com/em/datasheet/434113043826.pdf; Operating Temperature: -40 to +85degC; Part Number: 434113043826; Published Date: September 2019; Contact Material: Stainless Steel; Height: 4.3mm; Mounting Technology: SMT; Contact Plating: Silver; Operation Force: 260gf; Packaging: Tape and Reel; Terminal Material: Copper Alloy; Publisher: Wurth Elektronik; Terminal Plating: Silver
M3 = HC-05-06-TH: Local Supplier Link: https://hshop.vn/products/mach-thu-phat-bluetooth-hc-05-do-ra-chon-master; Local Supplier Part Number: HS000882; Manufacturer: *; Manufacturer Part Number: *; Local Supplier: HShop
M4 = HC-05-06-SMD: Local Supplier Link: https://hshop.vn/products/mach-thu-phat-bluetooth-hc-05-chua-ra-chon-master; Local Supplier Part Number: HS000881; Manufacturer: *; Manufacturer Part Number: *; Local Supplier: HShop

## Sheet Decawave.SchDoc
size A4
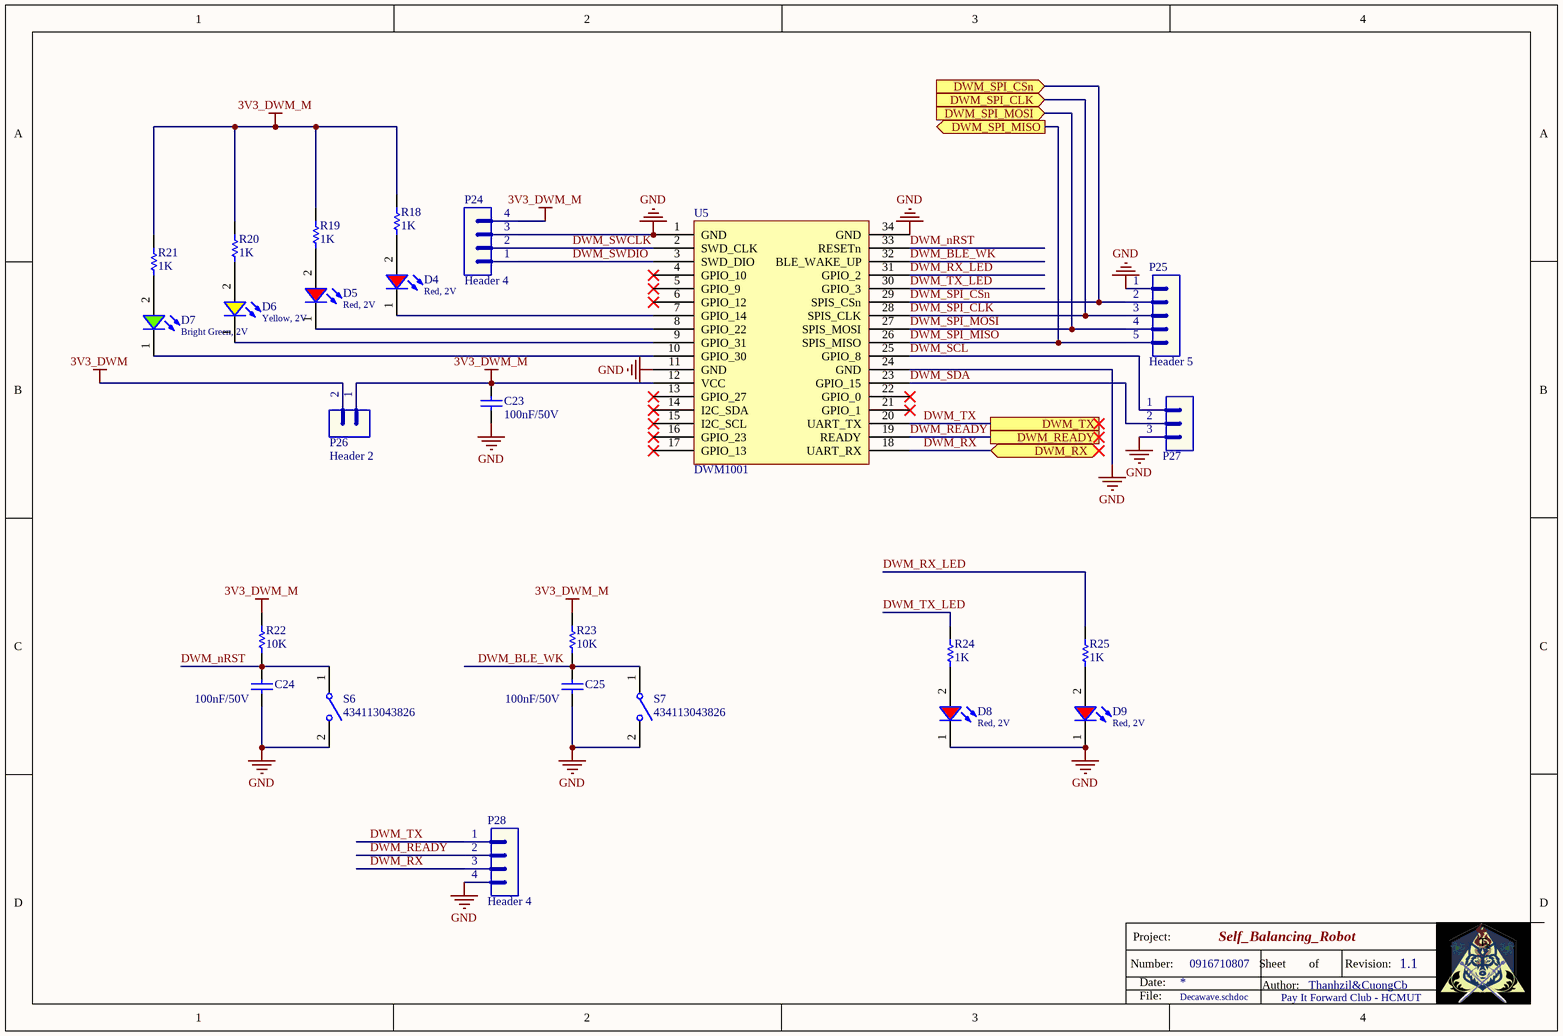
[diagram p5: Decawave.SchDoc]

### Parts
C23  value 100nF/50V  [CAP-SM-0805]  (hidden comment: Cap-100nF-50V-0805)
C24  value 100nF/50V  [CAP-SM-0805]  (hidden comment: Cap-100nF-50V-0805)
C25  value 100nF/50V  [CAP-SM-0805]  (hidden comment: Cap-100nF-50V-0805)
D4  Red, 2V  [WL-SMCW_0805]
D5  Red, 2V  [WL-SMCW_0805]
D6  Yellow, 2V  [WL-SMCW_0805]
D7  Bright Green, 2V  [WL-SMCW_0805]
D8  Red, 2V  [WL-SMCW_0805]
D9  Red, 2V  [WL-SMCW_0805]
P24  Header 4  [JP4]
P25  Header 5  [JP5]
P26  Header 2  [JP2]
P27  Header 3  [JP3]  (value not drawn)
P28  Header 4  [JP4]
R18  value 1K  [RES-SM-0805]  (hidden comment: Res-1K-0805)
R19  value 1K  [RES-SM-0805]  (hidden comment: Res-1K-0805)
R20  value 1K  [RES-SM-0805]  (hidden comment: Res-1K-0805)
R21  value 1K  [RES-SM-0805]  (hidden comment: Res-1K-0805)
R22  value 10K  [RES-SM-0805]  (hidden comment: Res-10k-0805)
R23  value 10K  [RES-SM-0805]  (hidden comment: Res-10k-0805)
R24  value 1K  [RES-SM-0805]  (hidden comment: Res-1K-0805)
R25  value 1K  [RES-SM-0805]  (hidden comment: Res-1K-0805)
S6  434113043826  [434113043826]
S7  434113043826  [434113043826]
U5  DWM1001  [DWM1001]

### Ports
DWM_READY, DWM_RX (bidir), DWM_SPI_CLK (in), DWM_SPI_CSn (in), DWM_SPI_MISO (out), DWM_SPI_MOSI (in), DWM_TX

### Nets
3V3_DWM: P26.2
3V3_DWM_M: C23.2 P24.4 P26.1 R18.2 R19.2 R20.2 R21.2 R22.2 R23.2 U5.12(VCC)
GND: C23.1 C24.2 C25.2 D8.1(K) D9.1(K) P24.3 P25.1 P27.3 P28.4 S6.2 S7.2 U5.1(GND) U5.11(GND) U5.24(GND) U5.34(GND)
DWM_BLE_WK: C25.1 R23.1 S7.1 U5.32(BLE_WAKE_UP)
DWM_nRST: C24.1 R22.1 S6.1 U5.33(RESETn)
DWM_READY: P28.2 U5.19(READY) ; port DWM_READY
DWM_RX: P28.3 U5.18(UART_RX) ; port DWM_RX
DWM_RX_LED: R25.2 U5.31(GPIO_2)
DWM_SCL: P27.1 U5.25(GPIO_8)
DWM_SDA: P27.2 U5.23(GPIO_15)
DWM_SPI_CLK: P25.3 U5.28(SPIS_CLK) ; port DWM_SPI_CLK
DWM_SPI_CSn: P25.2 U5.29(SPIS_CSn) ; port DWM_SPI_CSn
DWM_SPI_MISO: P25.5 U5.26(SPIS_MISO) ; port DWM_SPI_MISO
DWM_SPI_MOSI: P25.4 U5.27(SPIS_MOSI) ; port DWM_SPI_MOSI
DWM_SWCLK: P24.2 U5.2(SWD_CLK)
DWM_SWDIO: P24.1 U5.3(SWD_DIO)
DWM_TX: P28.1 U5.20(UART_TX) ; port DWM_TX
DWM_TX_LED: R24.2 U5.30(GPIO_3)
NetD4_1: D4.1(K) U5.7(GPIO_14)
NetD4_2: D4.2(A) R18.1
NetD5_1: D5.1(K) U5.8(GPIO_22)
NetD5_2: D5.2(A) R19.1
NetD6_1: D6.1(K) U5.9(GPIO_31)
NetD6_2: D6.2(A) R20.1
NetD7_1: D7.1(K) U5.10(GPIO_30)
NetD7_2: D7.2(A) R21.1
NetD8_2: D8.2(A) R24.1
NetD9_2: D9.2(A) R25.1

Not connected (* = marked no-connect by the designer): U5 4(GPIO_10)* 5(GPIO_9)* 6(GPIO_12)* 13(GPIO_27)* 14(I2C_SDA)* 15(I2C_SCL)* 16(GPIO_23)* 17(GPIO_13)* 21(GPIO_1)* 22(GPIO_0)*

### Notes on the sheet
- Date:
- Project:
- Number:
- 0916710807
- Self_Balancing_Robot
- Sheet
- Author:
- of
- Revision:
- 1.1
- Thanhzil&CuongCb
- Pay It Forward Club - HCMUT
- File:
- Decawave.schdoc

### Library data of the parts
C23-C25 = Cap-100nF-50V-0805: as C1 on sheet MCU; Local Supplier: thegioiic; Local Supplier Link: https://thegioiic.com/products/tu-100nf-0-1uf-50v-0805; Supplier 1: Digikey; Supplier 1 Part Number: 1276-1007-1-ND; Supplier 1 Link: https://www.digikey.com/product-detail/en/samsung-electro-mechanics/CL21F104ZBCNNNC/1276-1007-1-ND/3889093
D4 D5 D8 D9 = 150080RS75000: as D1 on sheet MCU; Viewing Angle: 140deg; ComponentLink1Description: Manufacturer; ComponentLink1URL: http://www.we-online.de; ComponentLink2URL: https://www.we-online.com/catalog/datasheet/150080RS75000.pdf; ComponentLink2Description: Datasheet; Forward Voltage typ.: 2V; Emitting Color: Red; Mounting Technology: SMT; Operating Temperature: -40 to +85degC; Published Date: December 2019; Part Number: 150080RS75000; Packaging: Tape and Reel; Size: 0805; Publisher: Wurth Elektronik
D6 = 150080YS75000: as D2 on sheet Bluetooth; Viewing Angle: 140deg; ComponentLink1Description: Manufacturer; ComponentLink1URL: http://www.we-online.de; ComponentLink2URL: https://www.we-online.com/catalog/datasheet/150080YS75000.pdf; ComponentLink2Description: Datasheet; Forward Voltage typ.: 2V; Emitting Color: Yellow; Mounting Technology: SMT; Operating Temperature: -40 to +85degC; Published Date: December 2019; Part Number: 150080YS75000; Packaging: Tape and Reel; Size: 0805; Publisher: Wurth Elektronik
D7 = 150080VS75000: WL-SMCW SMT Mono-color Chip LED Waterclear, size 0805, Bright Green, 2V, 140deg; Chip Technology: AlInGaP; Dominant Wavelength typ.: 570nm; Luminous Intensity typ.: 40mcd; Peak Wavelength typ.: 572nm; Viewing Angle: 140deg; ComponentLink1Description: Manufacturer; ComponentLink1URL: http://www.we-online.de; ComponentLink2URL: https://www.we-online.com/catalog/datasheet/150080VS75000.pdf; ComponentLink2Description: Datasheet; Forward Voltage typ.: 2V; Emitting Color: Bright Green; Mounting Technology: SMT; Operating Temperature: -40 to +85degC; Published Date: December 2019; Part Number: 150080VS75000; Packaging: Tape and Reel; Size: 0805; Publisher: Wurth Elektronik
P24 P28 = Header 4: Header, 4-Pin; LatestRevisionDate: 17-Jul-2002; LatestRevisionNote: Re-released for DXP Platform.; Publisher: Altium Limited
P25 = Header 5: Header, 5-Pin; LatestRevisionDate: 17-Jul-2002; LatestRevisionNote: Re-released for DXP Platform.; Publisher: Altium Limited
P26 = Header 2: Header, 2-Pin; LatestRevisionDate: 17-Jul-2002; LatestRevisionNote: Re-released for DXP Platform.; Publisher: Altium Limited
P27 = Header 3: Header, 3-Pin; LatestRevisionDate: 17-Jul-2002; LatestRevisionNote: Re-released for DXP Platform.; Publisher: Altium Limited
R18-R21 R24 R25 = Res-1K-0805: as R6 on sheet MCU; Local Supplier: thegioiic; Local Supplier Link: https://thegioiic.com/products/dien-tro-1k-ohm-0805-5; Supplier 1: Digikey; Supplier 1 Link: https://www.digikey.com/product-detail/en/stackpole-electronics-inc/RNCP0805FTD1K00/RNCP0805FTD1K00CT-ND/2240568; Supplier 1 Part Number: RNCP0805FTD1K00CT-ND
R22 R23 = Res-10k-0805: as R1 on sheet MCU; Local Supplier: thegioiic; Local Supplier Link: https://thegioiic.com/products/dien-tro-10k-ohm-0805-5; Supplier 1: Digikey; Supplier 1 Link: https://www.digikey.com/product-detail/en/stackpole-electronics-inc/RNCP0805FTD10K0/RNCP0805FTD10K0CT-ND/2240601; Supplier 1 Part Number: RNCP0805FTD10K0CT-ND
S6 S7 = 434113043826: as S1 on sheet MCU; ComponentLink1Description: Manufacturer; ComponentLink1URL: http://www.we-online.de; ComponentLink2Description: Datasheet; ComponentLink2URL: https://katalog.we-online.com/em/datasheet/434113043826.pdf; Operating Temperature: -40 to +85degC; Part Number: 434113043826; Published Date: September 2019; Contact Material: Stainless Steel; Height: 4.3mm; Mounting Technology: SMT; Contact Plating: Silver; Operation Force: 260gf; Packaging: Tape and Reel; Terminal Material: Copper Alloy; Publisher: Wurth Elektronik; Terminal Plating: Silver

## Sheet RF.SchDoc
size A4
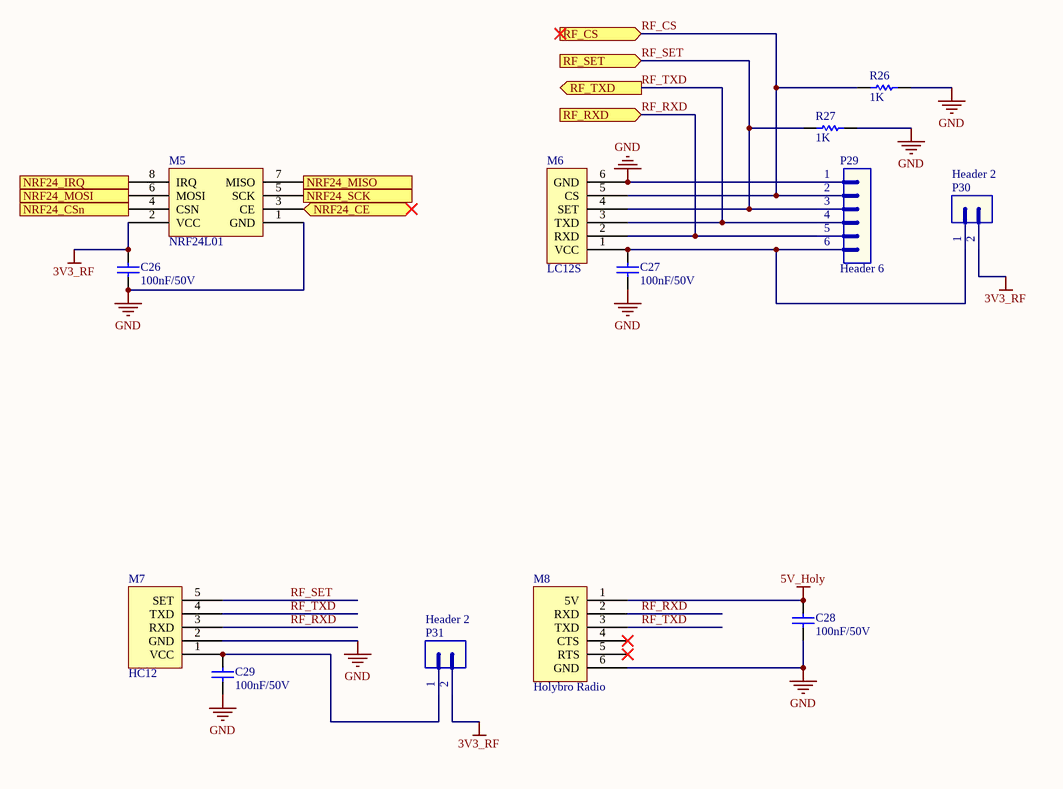
[diagram p6: RF.SchDoc]

### Parts
C26  value 100nF/50V  [CAP-SM-0805]  (hidden comment: Cap-100nF-50V-0805)
C27  value 100nF/50V  [CAP-SM-0805]  (hidden comment: Cap-100nF-50V-0805)
C28  value 100nF/50V  [CAP-SM-0805]  (hidden comment: Cap-100nF-50V-0805)
C29  value 100nF/50V  [CAP-SM-0805]  (hidden comment: Cap-100nF-50V-0805)
M5  NRF24L01  [NRF24L01]
M6  LC12S  [LC12S]
M7  HC12  [HC12]
M8  Holybro Radio  [HOLYBRO RADIO]
P29  Header 6  [JP6]
P30  Header 2  [JP2]
P31  Header 2  [JP2]
R26  value 1K  [RES-SM-0805]  (hidden comment: Res-1K-0805)
R27  value 1K  [RES-SM-0805]  (hidden comment: Res-1K-0805)

### Ports
NRF24_CE (bidir), NRF24_CSn (in), NRF24_IRQ (out), NRF24_MISO (out), NRF24_MOSI (in), NRF24_SCK (in), RF_CS (in), RF_RXD (in), RF_SET (in), RF_TXD (out)

### Nets
3V3_RF: C26.2 M5.2(VCC) P30.2 P31.2
5V_Holy: C28.2 M8.1(5V)  [project net 5V]
GND: C26.1 C27.1 C28.1 C29.1 M5.1(GND) M6.6(GND) M7.2(GND) M8.6(GND) P29.1 R26.2 R27.2
RF_CS: M6.5(CS) P29.2 R26.1 ; port RF_CS
RF_RXD: M6.2(RXD) M7.3(RXD) M8.2(RXD) P29.5 ; port RF_RXD
RF_SET: M6.4(SET) M7.5(SET) P29.3 R27.1 ; port RF_SET
RF_TXD: M6.3(TXD) M7.4(TXD) M8.3(TXD) P29.4 ; port RF_TXD
NetC27_2: C27.2 M6.1(VCC) P29.6 P30.1
NetC29_2: C29.2 M7.1(VCC) P31.1
NetM5_3: M5.3(CE) ; port NRF24_CE
NetM5_4: M5.4(CSN) ; port NRF24_CSn
NetM5_5: M5.5(SCK) ; port NRF24_SCK
NetM5_6: M5.6(MOSI) ; port NRF24_MOSI
NetM5_7: M5.7(MISO) ; port NRF24_MISO
NetM5_8: M5.8(IRQ) ; port NRF24_IRQ

Not connected (* = marked no-connect by the designer): M8 4(CTS)* 5(RTS)*

### Notes on the sheet
- Date:
- Project:
- Number:
- 0916710807
- Self_Balancing_Robot
- Sheet
- Author:
- of
- Revision:
- 1.1
- Thanhzil&CuongCb
- Pay It Forward Club - HCMUT
- File:
- RF.schdoc

### Library data of the parts
C26-C29 = Cap-100nF-50V-0805: as C1 on sheet MCU; Local Supplier: thegioiic; Local Supplier Link: https://thegioiic.com/products/tu-100nf-0-1uf-50v-0805; Supplier 1: Digikey; Supplier 1 Part Number: 1276-1007-1-ND; Supplier 1 Link: https://www.digikey.com/product-detail/en/samsung-electro-mechanics/CL21F104ZBCNNNC/1276-1007-1-ND/3889093
P29 = Header 6: Header, 6-Pin; LatestRevisionDate: 17-Jul-2002; LatestRevisionNote: Re-released for DXP Platform.; Publisher: Altium Limited
P30 P31 = Header 2: Header, 2-Pin; LatestRevisionDate: 17-Jul-2002; LatestRevisionNote: Re-released for DXP Platform.; Publisher: Altium Limited
R26 R27 = Res-1K-0805: as R6 on sheet MCU; Local Supplier: thegioiic; Local Supplier Link: https://thegioiic.com/products/dien-tro-1k-ohm-0805-5; Supplier 1: Digikey; Supplier 1 Link: https://www.digikey.com/product-detail/en/stackpole-electronics-inc/RNCP0805FTD1K00/RNCP0805FTD1K00CT-ND/2240568; Supplier 1 Part Number: RNCP0805FTD1K00CT-ND
M5 = NRF24L01: Local Supplier Link: https://hshop.vn/products/mach-thu-phat-nrf24l01-pa-2-4ghzcu-khech-dai-cung-suat-thu-phat; Local Supplier Part Number: HS000888; Manufacturer: *; Manufacturer Part Number: *; Local Supplier: HShop
M6 = LC12S: Local Supplier: HShop; Local Supplier Link: https://hshop.vn/products/mach-thu-phat-rf-uart-lc12s-2-4ghz; Local Supplier Part Number: HS000895; Manufacturer: *; Manufacturer Part Number: *
M7 = HC12: Local Supplier Link: https://hshop.vn/products/mach-thu-phat-rf-uart-si4463-433mhzkhoang-coch-1km; Local Supplier Part Number: HS000897; Manufacturer: *; Manufactuer Part Number: *; Local Supplier: HShop
M8 = HOLYBRO RADIO: Supploer Part Number: *; Supplier: *; Supploer Link: https://www.lazada.vn/products/ld-holybro-433mhz-915-mhz-500-mw-thu-phat-vo-tuyen-xa-bo-v3-cho-pixhawk-4-dieu-khien-chuyen-bay-i430804435-s768474304.html?spm=a2o4n.searchlist.list.4.25396b19yIS9XO&search=1; Manufacturer Part Number: *; Manufacturer: *

## Sheet Wifi.SchDoc
size A4
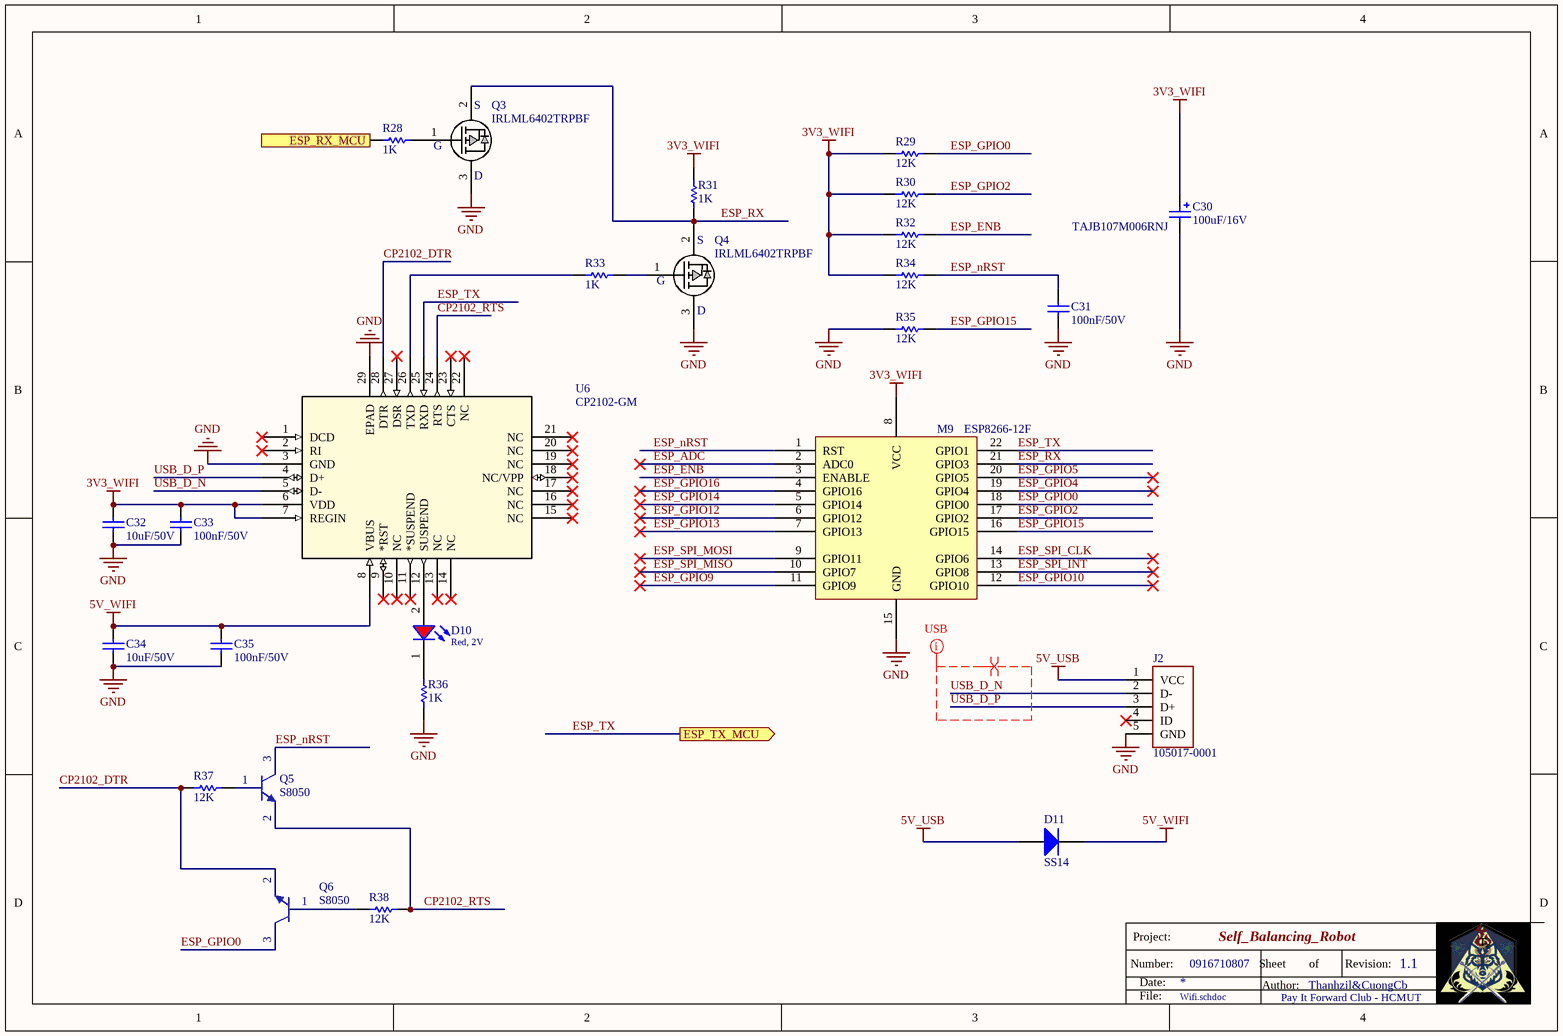
[diagram p7: Wifi.SchDoc]

### Parts
C30  value 100uF/16V  [CAP_SM_TAN]  (hidden comment: TAJB107M006RNJ)
C31  value 100nF/50V  [CAP-SM-0805]  (hidden comment: Cap-100nF-50V-0805)
C32  value 10uF/50V  [CAP-SM-0805]  (hidden comment: Cap-10uF-50V-0805)
C33  value 100nF/50V  [CAP-SM-0805]  (hidden comment: Cap-100nF-50V-0805)
C34  value 10uF/50V  [CAP-SM-0805]  (hidden comment: Cap-10uF-50V-0805)
C35  value 100nF/50V  [CAP-SM-0805]  (hidden comment: Cap-100nF-50V-0805)
D10  Red, 2V  [WL-SMCW_0805]
D11  SS14  [SS14]
J2  105017-0001  [CONN_105017-0001]
M9  ESP8266-12F  [ESP8266-12F]
Q3  IRLML6402TRPBF  [SOT23_NEX]
Q4  IRLML6402TRPBF  [SOT23_NEX]
Q5  S8050  [SOT23_NEX]
Q6  S8050  [SOT23_NEX]
R28  value 1K  [RES-SM-0805]  (hidden comment: Res-1K-0805)
R29  value 12K  [RES-SM-0805]  (hidden comment: Res-12K-0805)
R30  value 12K  [RES-SM-0805]  (hidden comment: Res-12K-0805)
R31  value 1K  [RES-SM-0805]  (hidden comment: Res-1K-0805)
R32  value 12K  [RES-SM-0805]  (hidden comment: Res-12K-0805)
R33  value 1K  [RES-SM-0805]  (hidden comment: Res-1K-0805)
R34  value 12K  [RES-SM-0805]  (hidden comment: Res-12K-0805)
R35  value 12K  [RES-SM-0805]  (hidden comment: Res-12K-0805)
R36  value 1K  [RES-SM-0805]  (hidden comment: Res-1K-0805)
R37  value 12K  [RES-SM-0805]  (hidden comment: Res-12K-0805)
R38  value 12K  [RES-SM-0805]  (hidden comment: Res-12K-0805)
U6  CP2102-GM  [CP2102-GM]

### Ports
ESP_RX_MCU (in), ESP_TX_MCU (out)

### Nets
3V3_WIFI: C30.1 C32.1 C33.2 M9.8(VCC) R29.1 R30.1 R31.2 R32.1 R34.1 U6.6(VDD) U6.7(REGIN)
5V_USB: D11.2(A) J2.1(VCC)
5V_WIFI: C34.2 C35.2 D11.1(K) U6.8(VBUS)
GND: C30.2 C31.1 C32.2 C33.1 C34.1 C35.1 J2.5(GND) M9.15(GND) Q3.3(D) Q4.3(D) R35.1 R36.1 U6.3(GND) U6.29(EPAD)
CP2102_DTR: Q6.2(E) R37.1 U6.28(DTR)
CP2102_RTS: Q5.2(E) R38.2 U6.24(RTS)
ESP_ADC: M9.2(ADC0)
ESP_ENB: M9.3(ENABLE) R32.2
ESP_GPIO0: M9.18(GPIO0) Q6.3(C) R29.2
ESP_GPIO2: M9.17(GPIO2) R30.2
ESP_GPIO4: M9.19(GPIO4)
ESP_GPIO5: M9.20(GPIO5)
ESP_GPIO9: M9.11(GPIO9)
ESP_GPIO10: M9.12(GPIO10)
ESP_GPIO12: M9.6(GPIO12)
ESP_GPIO13: M9.7(GPIO13)
ESP_GPIO14: M9.5(GPIO14)
ESP_GPIO15: M9.16(GPIO15) R35.2
ESP_GPIO16: M9.4(GPIO16)
ESP_nRST: C31.2 M9.1(RST) Q5.3(C) R34.2
ESP_RX: M9.21(GPIO3) Q3.2(S) Q4.2(S) R31.1
ESP_SPI_CLK: M9.14(GPIO6)
ESP_SPI_INT: M9.13(GPIO8)
ESP_SPI_MISO: M9.10(GPIO7)
ESP_SPI_MOSI: M9.9(GPIO11)
ESP_TX: M9.22(GPIO1) U6.25(RXD) ; port ESP_TX_MCU
USB_D_N: J2.2(D-) U6.5(D-)
USB_D_P: J2.3(D+) U6.4(D+)
NetD10_1: D10.1(K) R36.2
NetD10_2: D10.2(A) U6.12(SUSPEND)
NetQ3_1: Q3.1(G) R28.2
NetQ4_1: Q4.1(G) R33.1
NetQ5_1: Q5.1(B) R37.2
NetQ6_1: Q6.1(B) R38.1
NetR28_1: R28.1 ; port ESP_RX_MCU
NetR33_2: R33.2 U6.26(TXD)

Not connected (* = marked no-connect by the designer): J2 4(ID)*; U6 1(DCD)* 2(RI)* 9(*RST)* 10(NC)* 11(*SUSPEND)* 13(NC)* 14(NC)* 15(NC)* 16(NC)* 17(NC)* 18(NC/VPP)* 19(NC)* 20(NC)* 21(NC)* 22(NC)* 23(CTS)* 27(DSR)*

### Layout directives
differential pair: USB_D_N, USB_D_P
mark named USB: USB_D_N, USB_D_P

### Notes on the sheet
- (near C30) TAJB107M006RNJ
- Date:
- Project:
- Number:
- 0916710807
- Self_Balancing_Robot
- Sheet
- Author:
- of
- Revision:
- 1.1
- Thanhzil&CuongCb
- Pay It Forward Club - HCMUT
- File:
- Wifi.schdoc

### Library data of the parts
C30 = Cap-Tan-100uF-16V: Manufacturer: Nichicon; Manufacturer Part Number: UWX1C101MCL1GB; Local Supplier: icdayroi; Local Supplier Link: https://icdayroi.com/tu-tantalum-100uf-16v-smd6032; Supplier 1: Digikey; Supplier 1 Part Number: 493-2105-1-ND; Supplier 1 Link: https://www.digikey.com/product-detail/en/nichicon/UWX1C101MCL1GB/493-2105-1-ND/590080
C31 C33 C35 = Cap-100nF-50V-0805: as C1 on sheet MCU; Local Supplier: thegioiic; Local Supplier Link: https://thegioiic.com/products/tu-100nf-0-1uf-50v-0805; Supplier 1: Digikey; Supplier 1 Part Number: 1276-1007-1-ND; Supplier 1 Link: https://www.digikey.com/product-detail/en/samsung-electro-mechanics/CL21F104ZBCNNNC/1276-1007-1-ND/3889093
C32 C34 = Cap-10uF-50V-0805: as C7 on sheet Power_Supply; Local Supplier: thegioiic; Local Supplier Link: https://thegioiic.com/products/tu-10uf-50v-0805; Supplier 1: Digikey; Supplier 1 Link: https://www.digikey.com/product-detail/en/yageo/CC0805KKX5R9BB106/311-3499-2-ND/7164383; Supplier 1 Part Number: 311-3499-2-ND
D10 = 150080RS75000: as D1 on sheet MCU; Viewing Angle: 140deg; ComponentLink1Description: Manufacturer; ComponentLink1URL: http://www.we-online.de; ComponentLink2URL: https://www.we-online.com/catalog/datasheet/150080RS75000.pdf; ComponentLink2Description: Datasheet; Forward Voltage typ.: 2V; Emitting Color: Red; Mounting Technology: SMT; Operating Temperature: -40 to +85degC; Published Date: December 2019; Part Number: 150080RS75000; Packaging: Tape and Reel; Size: 0805; Publisher: Wurth Elektronik
D11 = Diode-SS14: DIODE SCHOTTKY 40V 1A SMA; Manufacturer: ON Semiconductor; Local Supplier: thegioiic; Local Supplier Link: https://thegioiic.com/products/ss14-sma; Supplier 1: Digikey; Supplier 1 Link: https://www.digikey.com/product-detail/en/on-semiconductor/SS14/SS14CT-ND/965729; Manufacturer Part Number: SS14; Supplier 1 Part Number: SS14CT-ND
J2 = 105017-0001: No Description Available; Vendor: Molex Connector Corporation; Built_By: EMA_Cory; SourceLibrary: Molex_2020-05-26; Datasheet: https://www.molex.com/pdm_docs/sd/1050170001_sd.pdf; Manufacturer_Part_Number: 105017-0001; Copyright: Copyright (C) 2018 Accelerated Designs. All rights reserved; RefDes: RefDes; Type: DEV
Q3 Q4 = IRLML6402TRPBF: P-Channel 20V 3.7A (Ta) 1.3W (Ta) Surface Mount Micro3™/SOT-23
R28 R31 R33 R36 = Res-1K-0805: as R6 on sheet MCU; Local Supplier: thegioiic; Local Supplier Link: https://thegioiic.com/products/dien-tro-1k-ohm-0805-5; Supplier 1: Digikey; Supplier 1 Link: https://www.digikey.com/product-detail/en/stackpole-electronics-inc/RNCP0805FTD1K00/RNCP0805FTD1K00CT-ND/2240568; Supplier 1 Part Number: RNCP0805FTD1K00CT-ND
R29 R30 R32 R34 R35 R37 R38 = Res-12K-0805: RES 12 KOHM JUMPER 0805; Manufacturer: Vishay Thin Film; Manufacturer Part Number: PAT0805E3121BST1; Local Supplier: icdayroi; Local Supplier Link: https://icdayroi.com/dien-tro-12k-0805-1-goi-50-con; Supplier 1: Digikey; Supplier 1 Link: https://www.digikey.com/product-detail/en/vishay-thin-film/PAT0805E3121BST1/PAT0805E3121BST1-ND/2281536; Supplier 1 Part Number: PAT0805E3121BST1-ND
U6 = CP2102-GM: Vendor: Silicon Labs; Built_By: EMA_UL_Team; SourceLibrary: Silicon_Labs_2015-03-23; Manufacturer_Part_Number: CP2102-GM; Copyright: Copyright (C) 2018 Accelerated Designs. All rights reserved; RefDes: RefDes; Type: DEV
M9 = ESP8266-12F: Local Supplier: HShop; Local Supplier Link: https://hshop.vn/products/mach-thu-phat-wifi-soc-esp8266-v12; Local Supplier Link Part Number: HS000912; Manufacturer: *; Manufacturer Part Number: *

## Nets that join several sheets
3V3 MCU: MCU (12 pins), Power_Supply (C10.2 C11.2 IC2.2 IC2.4), Sensor (6 pins), Motor_Controller (11 pins)
3V3_BLU: Power_Supply (C15.2 IC4.2 IC4.4), Bluetooth (M4.12 S5.1)
3V3_DWM: Power_Supply (C12.2 IC3.2 IC3.4), Decawave (P26.2)
3V3_RF: Power_Supply (C14.2 U2.5), RF (C26.2 M5.2 P30.2 P31.2)
3V3_WIFI: Power_Supply (C9.2 IC1.2 IC1.4), Wifi (11 pins)
5V: MCU (B1.1 J1.1), Power_Supply (10 pins), Bluetooth (C21.2 M3.5), RF (C28.2 M8.1)
5V_WIFI: Power_Supply (IC1.3 P6.2), Wifi (C34.2 C35.2 D11.1 U6.8)
12V: Power_Supply (C6.1 C7.2 P5.1 PI1.1), Motor_Controller (P9.1 P10.1)
GND: MCU (16 pins), Power_Supply (19 pins), Sensor (6 pins), Motor_Controller (20 pins), Bluetooth (10 pins), Decawave (15 pins), RF (11 pins), Wifi (14 pins)
BLU_KEY: MCU (U1.32), Bluetooth (C22.2 P22.2 R16.2 S5.2)
BLUE_RX: MCU (U1.30), Bluetooth (M3.2 M4.2 P23.2)
BLUE_TX: MCU (U1.31), Bluetooth (M3.3 M4.1 P23.1)
DWM_SPI_CLK: MCU (U1.26), Decawave (P25.3 U5.28)
DWM_SPI_CSn: MCU (U1.25), Decawave (P25.2 U5.29)
DWM_SPI_MISO: MCU (U1.27), Decawave (P25.5 U5.26)
DWM_SPI_MOSI: MCU (U1.28), Decawave (P25.4 U5.27)
ESP_TX: MCU (U1.13), Wifi (M9.22 U6.25)
NetB2_3: MCU (U1.45), Sensor (B2.3)
NetB2_4: MCU (U1.46), Sensor (B2.4)
NetM4_11: MCU (U1.14), Bluetooth (M4.11)
NetM5_4: MCU (U1.38), RF (M5.4)
NetM5_5: MCU (U1.39), RF (M5.5)
NetM5_6: MCU (U1.41), RF (M5.6)
NetM5_7: MCU (U1.40), RF (M5.7)
NetM5_8: MCU (U1.33), RF (M5.8)
NetR8_1: MCU (U1.15), Power_Supply (R8.1)
NetR28_1: MCU (U1.12), Wifi (R28.1)
NetU1_3: MCU (U1.3), Motor_Controller (U4.3)
NetU1_4: MCU (U1.4), Motor_Controller (U4.6)
NetU1_5: MCU (U1.5), Motor_Controller (U4.5)
NetU1_6: MCU (U1.6), Motor_Controller (U4.7)
NetU1_10: MCU (U1.10), Motor_Controller (U4.2)
NetU1_11: MCU (U1.11), Motor_Controller (U4.4)
NetU1_16: MCU (U1.16), Sensor (U3.2)
NetU1_17: MCU (U1.17), Sensor (U3.4)
NetU1_42: MCU (U1.42), Sensor (U3.8)
NetU1_43: MCU (U1.43), Sensor (U3.6)
RF_RXD: MCU (U1.21), RF (M6.2 M7.3 M8.2 P29.5)
RF_SET: MCU (U1.19), RF (M6.4 M7.5 P29.3 R27.1)
RF_TXD: MCU (U1.22), RF (M6.3 M7.4 M8.3 P29.4)